# EasyEDA schematic 1-Schematic_PeakEndFlowerShield H-bridge.json
TITLE: Sheet_1; REV: 1.0; Date: 2021-02-16; Sheet: 1/1; Company: Your Company
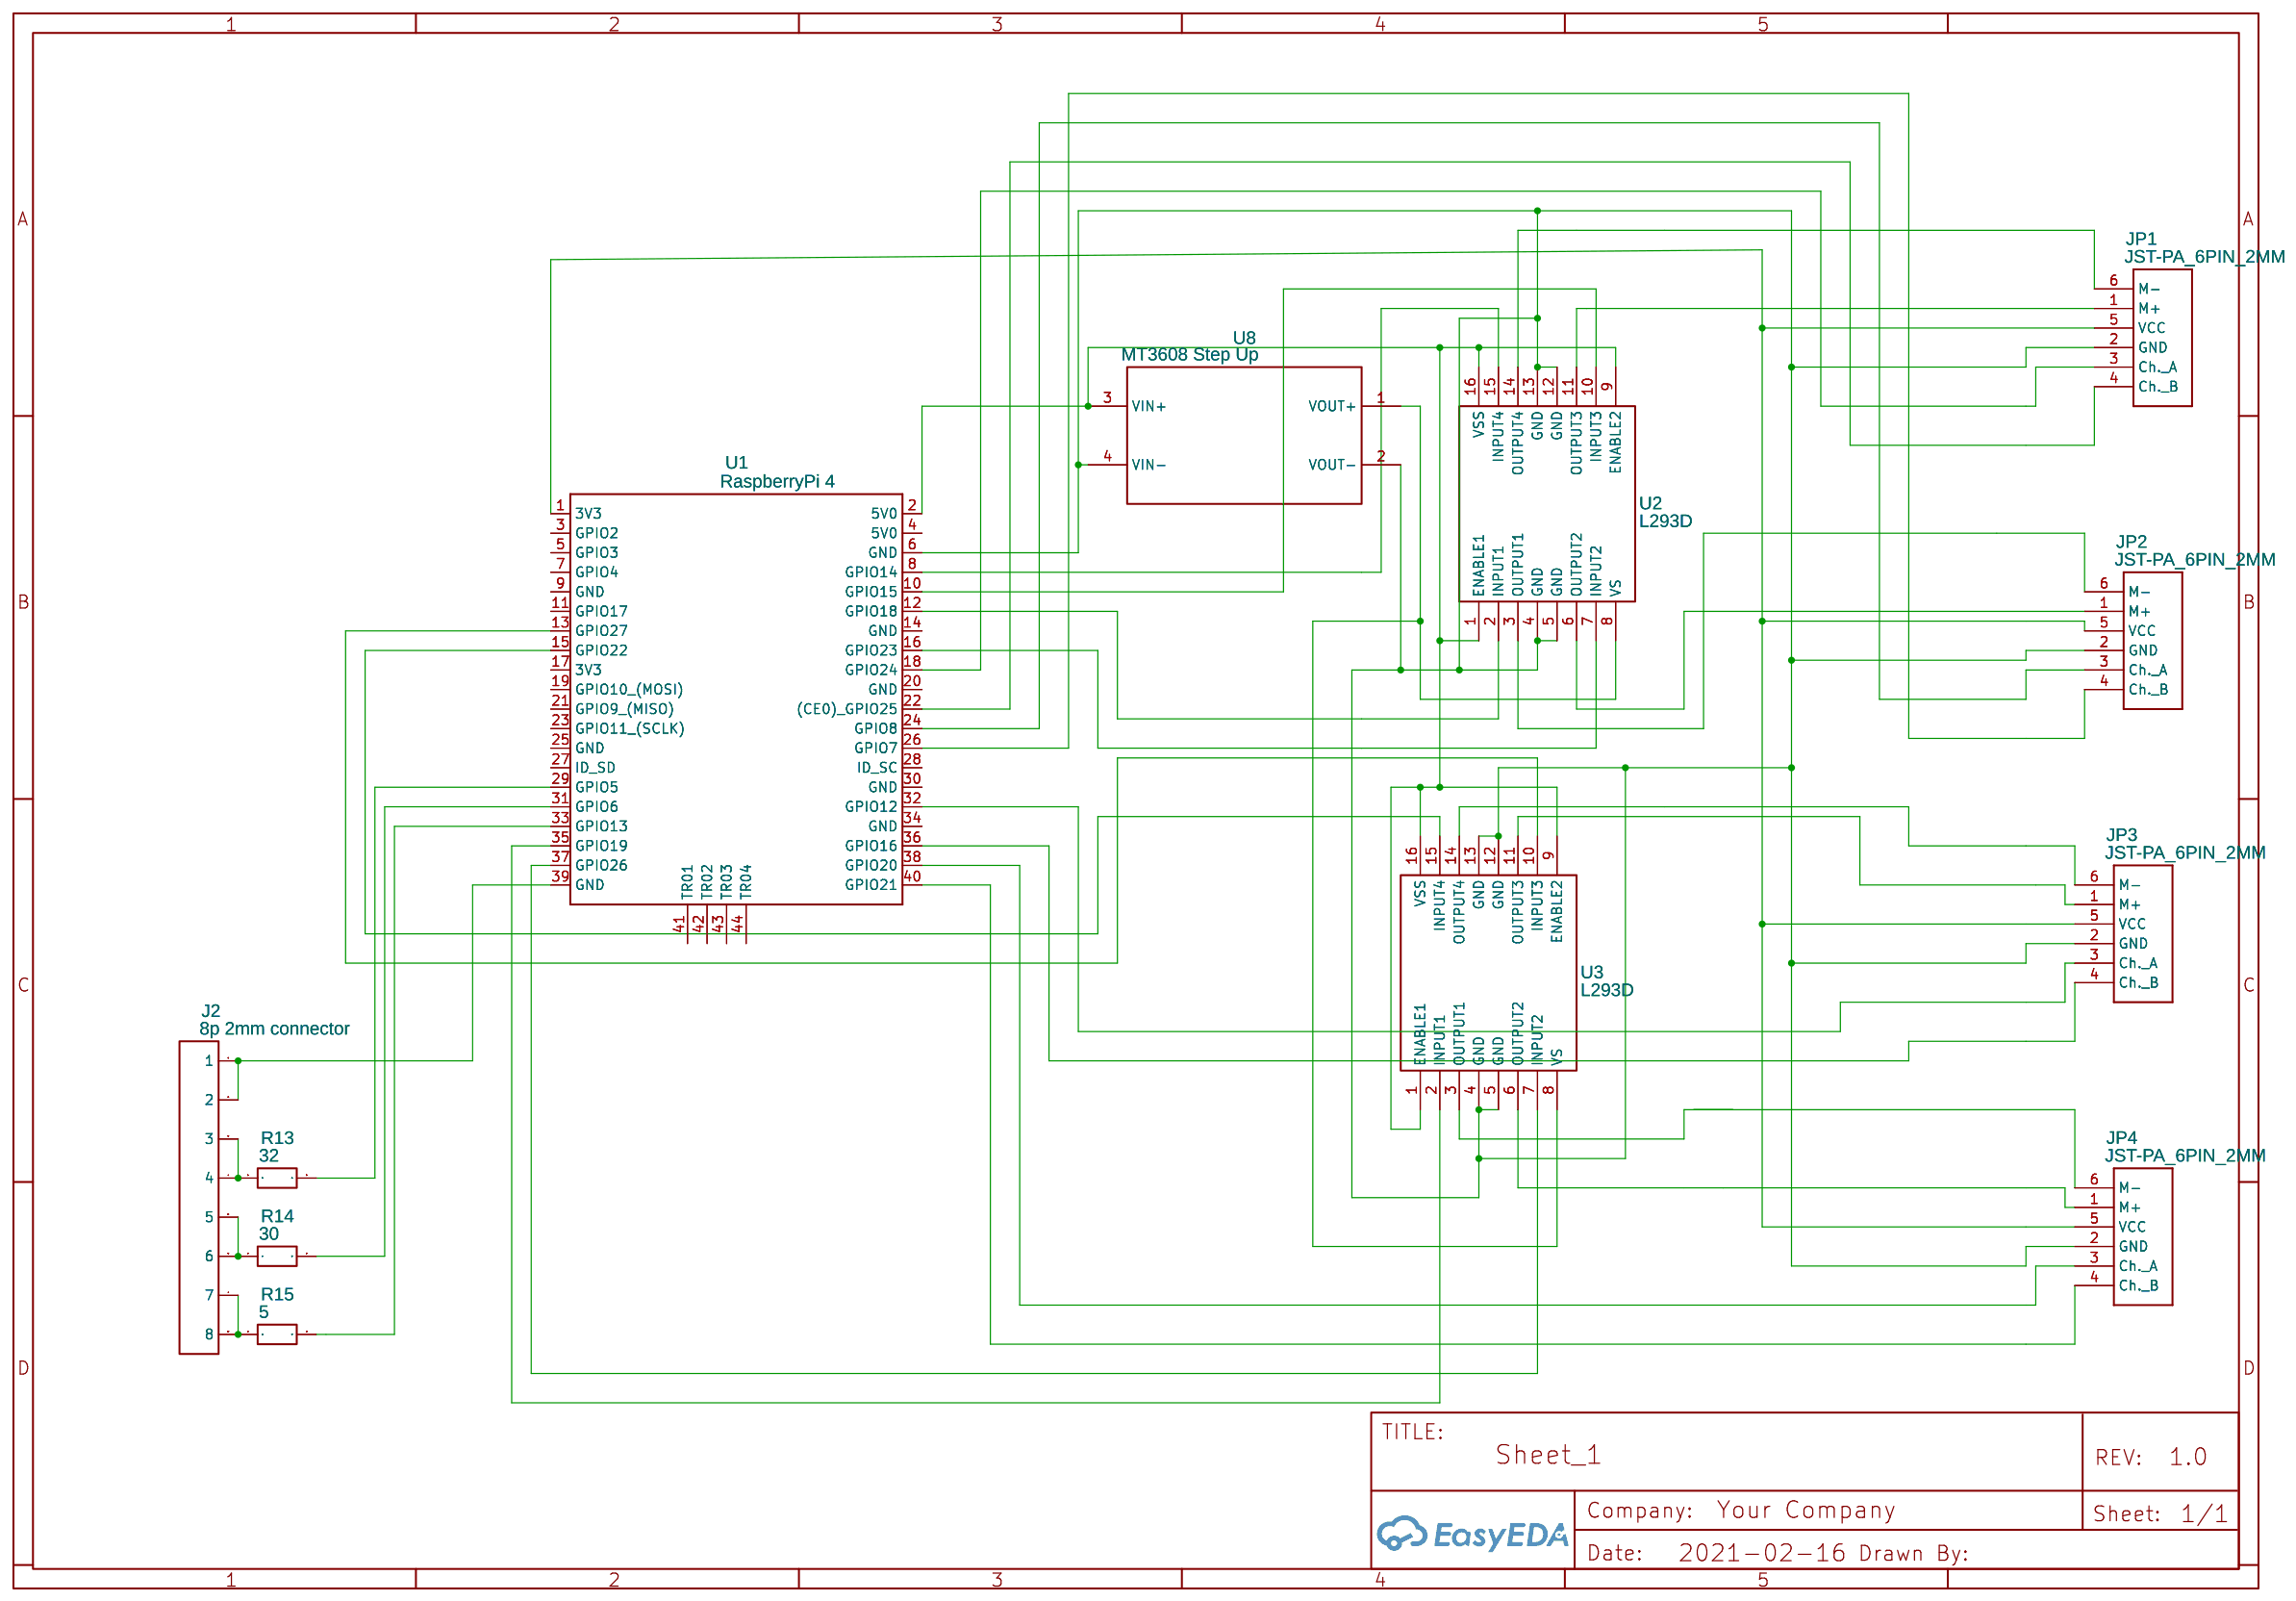
[diagram p0: schematic sheet]

## Parts
J2  8p 2mm connector  [8P 2MM]
JP1  JST-PA_6PIN_2MM  [JST-PA_6PIN_2MM]
JP2  JST-PA_6PIN_2MM  [JST-PA_6PIN_2MM]
JP3  JST-PA_6PIN_2MM  [JST-PA_6PIN_2MM]
JP4  JST-PA_6PIN_2MM  [JST-PA_6PIN_2MM]
R13  32  [R_AXIAL-0.3]
R14  30  [R_AXIAL-0.3]
R15  5  [R_AXIAL-0.3]
U1  RaspberryPi 4  [RASBERRYPI-4-HAT]
U2  L293D  [DIP-16_L20.0-W6.4-P2.54-LS7.6-BL]
U3  L293D  [DIP-16_L20.0-W6.4-P2.54-LS7.6-BL]
U8  MT3608 Step Up  [MT3608-1]

## Library data of the parts
J2 = 8p 2mm connector: Contributor: GonzoG
JP1-JP4 = JST-PA_6PIN_2MM: Contributor: Mehmet AKBAS
R13-R15 = R_AXIAL-0.3_EU: Contributor: LCEDA_Lib
U1 = RaspberryPi 4: Contributor: lynxlabeling
U2 U3 = L293D: Contributor: pitreluc; Supplier: LCSC; Manufacturer: STMicroelectronics; Supplier Part: C12340; JLCPCB Part Class: Extended Part
U8 = MT3608 Step Up: Manufacturer Part: mt3608-1; Contributor: evillee1123

## Nets
Net-(J2-1): J2.1 J2.2 U1.39(GND)
Net-(J2-3): J2.3 J2.4 R13.1
Net-(J2-5): J2.5 J2.6 R14.1
Net-(J2-7): J2.7 J2.8 R15.1
Net-(JP1-1): JP1.1(M+) U2.11(OUTPUT3)
Net-(JP1-2): JP1.2(GND) JP2.2(GND) JP3.2(GND) JP4.2(GND) U1.6(GND) U2.4(GND) U2.5(GND) U2.12(GND) U2.13(GND) U3.4(GND) U3.5(GND) U3.12(GND) U3.13(GND) U8.2(VOUT-) U8.4(VIN-)
Net-(JP1-3): JP1.3(Ch. A) U1.18(GPIO24)
Net-(JP1-4): JP1.4(Ch. B) U1.22((CE0) GPIO25)
Net-(JP1-5): JP1.5(VCC) JP2.5(VCC) JP3.5(VCC) JP4.5(VCC) U1.1(3V3)
Net-(JP1-6): JP1.6(M-) U2.14(OUTPUT4)
Net-(JP2-1): JP2.1(M+) U2.6(OUTPUT2)
Net-(JP2-3): JP2.3(Ch. A) U1.24(GPIO8)
Net-(JP2-4): JP2.4(Ch. B) U1.26(GPIO7)
Net-(JP2-6): JP2.6(M-) U2.3(OUTPUT1)
Net-(JP3-1): JP3.1(M+) U3.11(OUTPUT3)
Net-(JP3-3): JP3.3(Ch. A) U1.32(GPIO12)
Net-(JP3-4): JP3.4(Ch. B) U1.36(GPIO16)
Net-(JP3-6): JP3.6(M-) U3.14(OUTPUT4)
Net-(JP4-1): JP4.1(M+) U3.6(OUTPUT2)
Net-(JP4-3): JP4.3(Ch. A) U1.38(GPIO20)
Net-(JP4-4): JP4.4(Ch. B) U1.40(GPIO21)
Net-(JP4-6): JP4.6(M-) U3.3(OUTPUT1)
Net-(R13-2): R13.2 U1.29(GPIO5)
Net-(R14-2): R14.2 U1.31(GPIO6)
Net-(R15-2): R15.2 U1.33(GPIO13)
Net-(U1-2): U1.2(5V0) U2.1(ENABLE1) U2.9(ENABLE2) U2.16(VSS) U3.1(ENABLE1) U3.9(ENABLE2) U3.16(VSS) U8.3(VIN+)
Net-(U1-8): U1.8(GPIO14) U2.15(INPUT4)
Net-(U1-10): U1.10(GPIO15) U2.10(INPUT3)
Net-(U1-12): U1.12(GPIO18) U2.2(INPUT1)
Net-(U1-13): U1.13(GPIO27) U3.10(INPUT3)
Net-(U1-15): U1.15(GPIO22) U3.15(INPUT4)
Net-(U1-16): U1.16(GPIO23) U2.7(INPUT2)
Net-(U1-35): U1.35(GPIO19) U3.2(INPUT1)
Net-(U1-37): U1.37(GPIO26) U3.7(INPUT2)
Net-(U2-8): U2.8(VS) U3.8(VS) U8.1(VOUT+)

Not connected (* = marked no-connect by the designer): U1 3(GPIO2) 4(5V0) 5(GPIO3) 7(GPIO4) 9(GND) 11(GPIO17) 14(GND) 17(3V3) 19(GPIO10 (MOSI)) 20(GND) 21(GPIO9 (MISO)) 23(GPIO11 (SCLK)) 25(GND) 27(ID_SD) 28(ID_SC) 30(GND) 34(GND) 41(TR01) 42(TR02) 43(TR03) 44(TR04)
